# Altium project OLEDMiniFly.PrjPCB
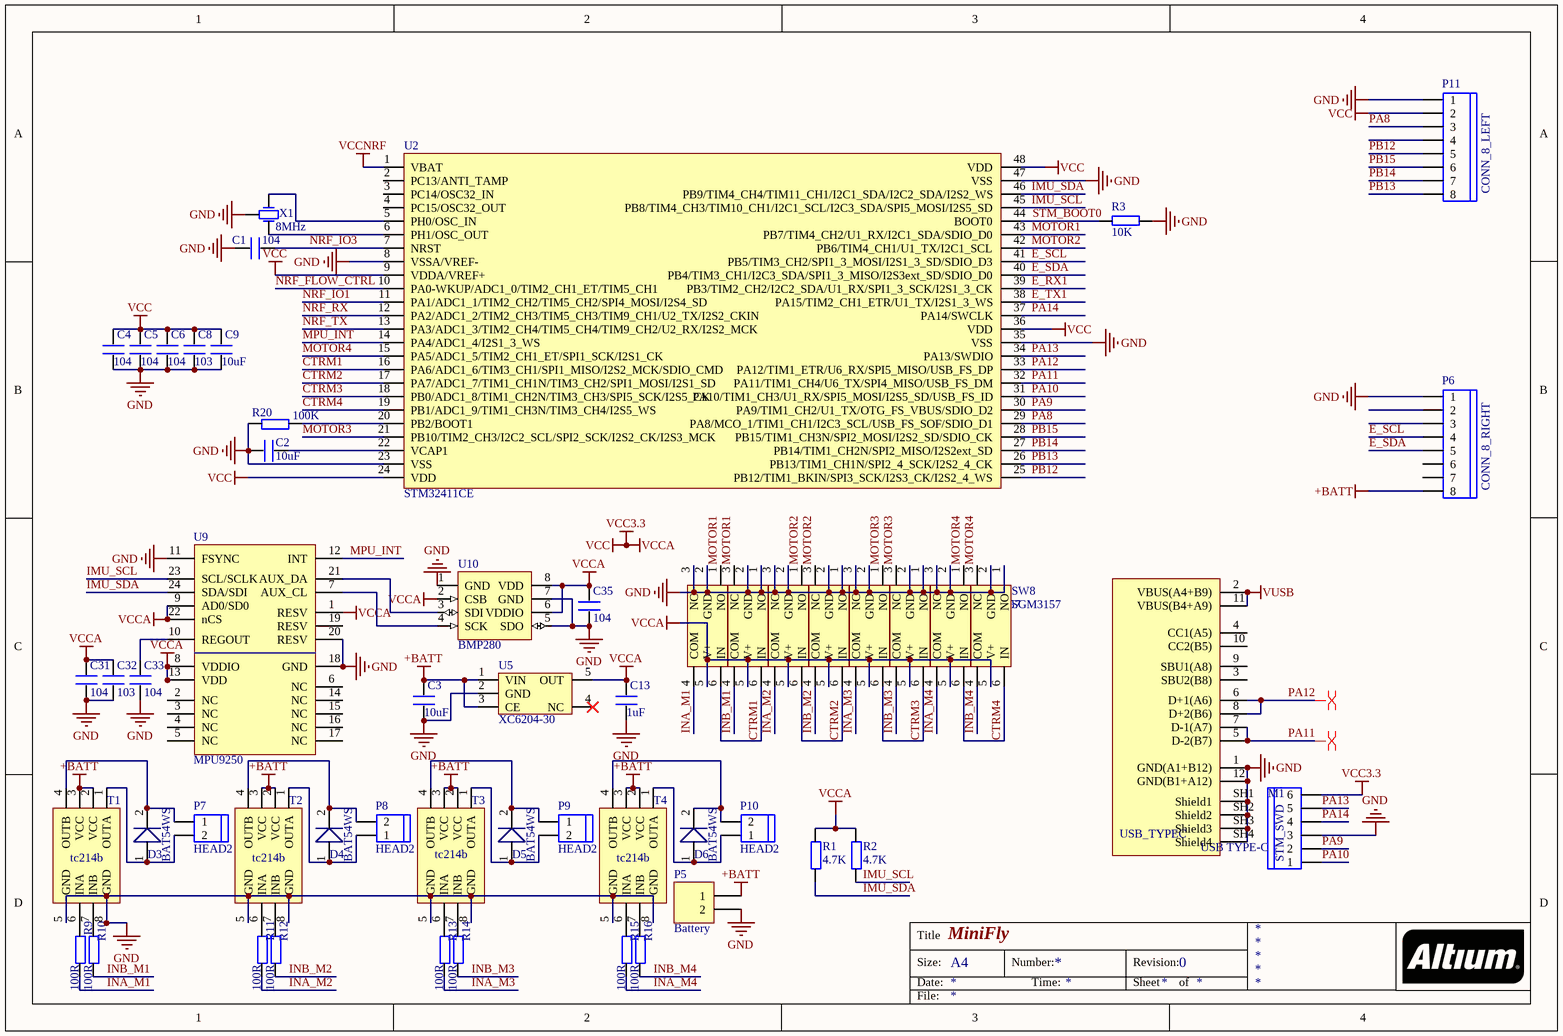
[diagram p0: OLEDMiniFlyMCU.SchDoc]
2 sheets, 83 parts. Net scope: global (net labels, ports and power ports of the same name join across sheets).
Board file: OLEDMiniFly.PcbDoc
Sheets:
  OLEDMiniFlyMCU.SchDoc
  OLEDMiniFlyNRF.SchDoc

## Sheet OLEDMiniFlyMCU.SchDoc: MiniFly
size A4; Author: liujun6037; Revision: 0; Version: V1.32; SheetSize: A4

### Parts
C1  104  [C 0603_L]
C2  10uF  [C 0603_L]
C3  10uF  [C 0603_L]
C4  104  [C 0603_L]
C5  104  [C 0603_L]
C6  104  [C 0603_L]
C8  103  [C 0603_L]
C9  10uF  [C 0603_L]
C13  1uF  [C 0603_L]
C31  104  [C 0603_L]
C32  103  [C 0603_L]
C33  104  [C 0603_L]
C35  104  [C 0603_L]
D3  BAT54WS  [SOD-323]
D4  BAT54WS  [SOD-323]
D5  BAT54WS  [SOD-323]
D6  BAT54WS  [SOD-323]
M1  STM_SWD  [SH1.0_6P]
P5  Battery  [HDR1X2]
P6  CONN_8_RIGHT  [HEADER8-2.0MM]
P7  HEAD2  [HEADER2-1.25MM]
P8  HEAD2  [HEADER2-1.25MM]
P9  HEAD2  [HEADER2-1.25MM]
P10  HEAD2  [HEADER2-1.25MM]
P11  CONN_8_LEFT  [HEADER8-2.0MM]
R1  4.7K  [R 0603_L]
R2  4.7K  [R 0603_L]
R3  10K  [R 0603_L]
R9  100R  [R 0603_L]
R10  100R  [R 0603_L]
R11  100R  [R 0603_L]
R12  100R  [R 0603_L]
R13  100R  [R 0603_L]
R14  100R  [R 0603_L]
R15  100R  [R 0603_L]
R16  100R  [R 0603_L]
R20  100K  [R 0603_L]
SW1  SGM3157  [SOT363-6L]
SW2  SGM3157  [SOT363-6L]
SW3  SGM3157  [SOT363-6L]
SW4  SGM3157  [SOT363-6L]
SW5  SGM3157  [SOT363-6L]
SW6  SGM3157  [SOT363-6L]
SW7  SGM3157  [SOT363-6L]
SW8  SGM3157  [SOT363-6L]
T1  tc214b  [SOP8_L]
T2  tc214b  [SOP8_L]
T3  tc214b  [SOP8_L]
T4  tc214b  [SOP8_L]
U2  STM32411CE  [UFQFPN48]
U5  XC6204-30  [SOT23-5L]
U9  MPU9250  [MPU9250]
U10  BMP280  [LGA-8]
USB_TYPEC  USB TypeC  [USB Type-C]  (value not drawn)
X1  8MHz  [XTAL-3215-3P]

### Nets
+BATT: C3.2 P5.1 P6.8 T1.2(VCC) T1.3(VCC) T2.2(VCC) T2.3(VCC) T3.2(VCC) T3.3(VCC) T4.2(VCC) T4.3(VCC) U5.1(VIN) U5.3(CE)
GND: C1.2 C2.1 C3.1 C4.1 C5.1 C6.1 C8.1 C9.1 C13.1 C31.1 C32.1 C33.1 C35.1 M1.3 P5.2 P6.1 P11.1 R3.1 R20.1 SW1.2(GND) SW1.3(NC) SW2.1(NO) SW2.2(GND) SW3.2(GND) SW3.3(NC) SW4.1(NO) SW4.2(GND) SW5.2(GND) SW5.3(NC) SW6.1(NO) SW6.2(GND) SW7.2(GND) SW7.3(NC) SW8.1(NO) SW8.2(GND) T1.5(GND) T1.8(GND) T2.5(GND) T2.8(GND) T3.5(GND) T3.8(GND) T4.5(GND) T4.8(GND) U2.8(VSSA/VREF-) U2.23(VSS) U2.35(VSS) U2.47(VSS) U5.2(GND) U9.11(FSYNC) U9.18(GND) U9.20(RESV) U10.1(GND) U10.5(SDO) U10.7(GND) USB_TYPEC.1(GND(A1+B12)) USB_TYPEC.12(GND(B1+A12)) USB_TYPEC.SH1(Shield1) USB_TYPEC.SH2(Shield2) USB_TYPEC.SH3(Shield3) USB_TYPEC.SH4(Shield4) X1.2(GND)
VCC: C4.2 C5.2 C6.2 C8.2 C9.2 C13.2 C31.2 C32.2 C35.2 M1.6 P11.2 R1.2 R2.2 SW1.5(V+) SW2.5(V+) SW3.5(V+) SW4.5(V+) SW5.5(V+) SW6.5(V+) SW7.5(V+) SW8.5(V+) U2.9(VDDA/VREF+) U2.24(VDD) U2.36(VDD) U2.48(VDD) U5.5(OUT) U9.1(RESV) U9.8(VDDIO) U9.9(AD0/SD0) U9.13(VDD) U9.22(nCS) U10.2(CSB) U10.6(VDDIO) U10.8(VDD)  [also labelled VCC3.3, VCCA]
VCCNRF: U2.1(VBAT)
VUSB: USB_TYPEC.2(VBUS(A4+B9)) USB_TYPEC.11(VBUS(B4+A9))
CTRM1: SW1.6(IN) SW2.6(IN) U2.16(PA6/ADC1_6/TIM3_CH1/SPI1_MISO/I2S2_MCK/SDIO_CMD)
CTRM2: SW3.6(IN) SW4.6(IN) U2.17(PA7/ADC1_7/TIM1_CH1N/TIM3_CH2/SPI1_MOSI/I2S1_SD)
CTRM3: SW5.6(IN) SW6.6(IN) U2.18(PB0/ADC1_8/TIM1_CH2N/TIM3_CH3/SPI5_SCK/I2S5_CK)
CTRM4: SW7.6(IN) SW8.6(IN) U2.19(PB1/ADC1_9/TIM1_CH3N/TIM3_CH4/I2S5_WS)
E_RX1: U2.39(PB3/TIM2_CH2/I2C2_SDA/U1_RX/SPI1_3_SCK/I2S1_3_CK)
E_SCL: P6.4 U2.41(PB5/TIM3_CH2/SPI1_3_MOSI/I2S1_3_SD/SDIO_D3)
E_SDA: P6.5 U2.40(PB4/TIM3_CH1/I2C3_SDA/SPI1_3_MISO/I2S3ext_SD/SDIO_D0)
E_TX1: U2.38(PA15/TIM2_CH1_ETR/U1_TX/I2S1_3_WS)
IMU_SCL: R2.1 U2.45(PB8/TIM4_CH3/TIM10_CH1/I2C1_SCL/I2C3_SDA/SPI5_MOSI/I2S5_SD) U9.23(SCL/SCLK)
IMU_SDA: R1.1 U2.46(PB9/TIM4_CH4/TIM11_CH1/I2C1_SDA/I2C2_SDA/I2S2_WS) U9.24(SDA/SDI)
INA_M1: R9.1 SW1.4(COM)
INA_M2: R11.1 SW3.4(COM)
INA_M3: R13.1 SW5.4(COM)
INA_M4: R15.1 SW7.4(COM)
INB_M1: R10.1 SW2.4(COM)
INB_M2: R12.1 SW4.4(COM)
INB_M3: R14.1 SW6.4(COM)
INB_M4: R16.1 SW8.4(COM)
MOTOR1: SW1.1(NO) SW2.3(NC) U2.43(PB7/TIM4_CH2/U1_RX/I2C1_SDA/SDIO_D0)
MOTOR2: SW3.1(NO) SW4.3(NC) U2.42(PB6/TIM4_CH1/U1_TX/I2C1_SCL)
MOTOR3: SW5.1(NO) SW6.3(NC) U2.21(PB10/TIM2_CH3/I2C2_SCL/SPI2_SCK/I2S2_CK/I2S3_MCK)
MOTOR4: SW7.1(NO) SW8.3(NC) U2.15(PA5/ADC1_5/TIM2_CH1_ET/SPI1_SCK/I2S1_CK)
MPU_INT: U2.14(PA4/ADC1_4/I2S1_3_WS) U9.12(INT)
NRF_FLOW_CTRL: U2.10(PA0-WKUP/ADC1_0/TIM2_CH1_ET/TIM5_CH1)
NRF_IO1: U2.11(PA1/ADC1_1/TIM2_CH2/TIM5_CH2/SPI4_MOSI/I2S4_SD)
NRF_IO3: C1.1 U2.7(NRST)
NRF_RX: U2.12(PA2/ADC1_2/TIM2_CH3/TIM5_CH3/TIM9_CH1/U2_TX/I2S2_CKIN)
NRF_TX: U2.13(PA3/ADC1_3/TIM2_CH4/TIM5_CH4/TIM9_CH2/U2_RX/I2S2_MCK)
PA8: P11.3 U2.29(PA8/MCO_1/TIM1_CH1/I2C3_SCL/USB_FS_SOF/SDIO_D1)
PA9: M1.2 U2.30(PA9/TIM1_CH2/U1_TX/OTG_FS_VBUS/SDIO_D2)
PA10: M1.1 U2.31(PA10/TIM1_CH3/U1_RX/SPI5_MOSI/I2S5_SD/USB_FS_ID)
PA11: U2.32(PA11/TIM1_CH4/U6_TX/SPI4_MISO/USB_FS_DM) USB_TYPEC.5(D-2(B7)) USB_TYPEC.7(D-1(A7))
PA12: U2.33(PA12/TIM1_ETR/U6_RX/SPI5_MISO/USB_FS_DP) USB_TYPEC.6(D+1(A6)) USB_TYPEC.8(D+2(B6))
PA13: M1.5 U2.34(PA13/SWDIO)
PA14: M1.4 U2.37(PA14/SWCLK)
PB12: P11.5 U2.25(PB12/TIM1_BKIN/SPI3_SCK/I2S3_CK/I2S2_4_WS)
PB13: P11.8 U2.26(PB13/TIM1_CH1N/SPI2_4_SCK/I2S2_4_CK)
PB14: P11.7 U2.27(PB14/TIM1_CH2N/SPI2_MISO/I2S2ext_SD)
PB15: P11.6 U2.28(PB15/TIM1_CH3N/SPI2_MOSI/I2S2_SD/SDIO_CK)
STM_BOOT0: R3.2 U2.44(BOOT0)
NetC2_2: C2.2 U2.22(VCAP1)
NetC33_2: C33.2 U9.10(REGOUT)
NetD3_1: D3.1 P7.2 T1.1(OUTA)
NetD3_2: D3.2 P7.1 T1.4(OUTB)
NetD4_1: D4.1 P8.1 T2.1(OUTA)
NetD4_2: D4.2 P8.2 T2.4(OUTB)
NetD5_1: D5.1 P9.2 T3.1(OUTA)
NetD5_2: D5.2 P9.1 T3.4(OUTB)
NetD6_1: D6.1 P10.1 T4.1(OUTA)
NetD6_2: D6.2 P10.2 T4.4(OUTB)
NetR9_2: R9.2 T1.6(INA)
NetR10_2: R10.2 T1.7(INB)
NetR11_2: R11.2 T2.6(INA)
NetR12_2: R12.2 T2.7(INB)
NetR13_2: R13.2 T3.6(INA)
NetR14_2: R14.2 T3.7(INB)
NetR15_2: R15.2 T4.6(INA)
NetR16_2: R16.2 T4.7(INB)
NetR20_2: R20.2 U2.20(PB2/BOOT1)
NetU2_5: U2.5(PH0/OSC_IN) X1.1(OSC1)
NetU2_6: U2.6(PH1/OSC_OUT) X1.3(OSC2)
NetU9_7: U9.7(AUX_CL) U10.4(SCK)
NetU9_21: U9.21(AUX_DA) U10.3(SDI)

Not connected (* = marked no-connect by the designer): P6 2 3 6 7; P11 4; U2 2(PC13/ANTI_TAMP) 3(PC14/OSC32_IN) 4(PC15/OSC32_OUT); U5 4(NC)*; U9 2(NC) 3(NC) 4(NC) 5(NC) 6(NC) 14(NC) 15(NC) 16(NC) 17(NC) 19(RESV); USB_TYPEC 3(SBU2(B8)) 4(CC1(A5)) 9(SBU1(A8)) 10(CC2(B5))

### Layout directives
differential pair: PA11, PA12

### Notes on the sheet
- Title
- Size:
- Date:
- A4
- Number:
- Time:
- Revision:
- Sheet
- of
- File:
- (in symbol USB Type-C) USB TYPE-C

### Library data of the parts
C1-C6 C8 C9 C13 C31-C33 C35 = C
D3-D6 = BAT54: 单肖特基二极管
M1 = HEAD6
P5 = Header 2: Header, 2-Pin; LatestRevisionDate: 17-Jul-2002; LatestRevisionNote: Re-released for DXP Platform.; Publisher: Altium Limited
P6 P11 = HEAD8
R1-R3 R9-R16 R20 = R
SW1-SW8 = SGM3157: 单路双掷模拟开关
T1-T4 = tc214b: 马达驱动芯片
U2 = STM32F411xC_xE: STM32411xC_xE
U5 = XC6204
U9 = MPU9250: 9轴陀螺仪
U10 = BMP280: 气压传感器
USB_TYPEC = USB Type-C: 12P TypeC 母座
X1 = XTAL-3215

## Sheet OLEDMiniFlyNRF.SchDoc: MiniFly
size A4; Author: liujun6037; Revision: 0; Version: V1.32; SheetSize: A4
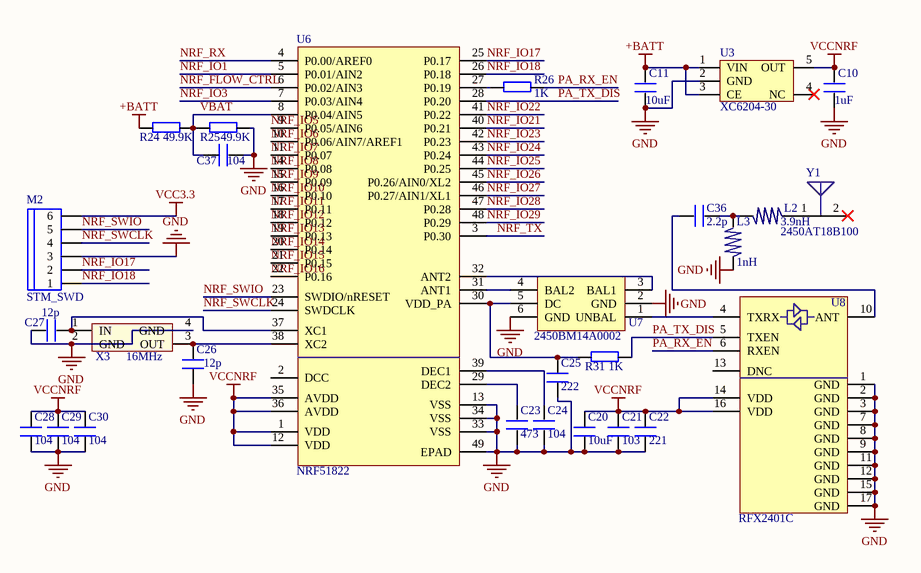
[diagram p1: OLEDMiniFlyNRF.SchDoc]

### Parts
C10  1uF  [C 0603_L]
C11  10uF  [C 0603_L]
C20  10uF  [C 0603_L]
C21  103  [C 0603_L]
C22  221  [C 0603_L]
C23  473  [C 0603_L]
C24  104  [C 0603_L]
C25  222  [C 0603_L]
C26  12p  [C 0603_L]
C27  12p  [C 0603_L]
C28  104  [C 0603_L]
C29  104  [C 0603_L]
C30  104  [C 0603_L]
C36  2.2p  [0402]
C37  104  [C 0603_L]
L2  3.9nH  [0402]
L3  1nH  [0402]
M2  STM_SWD  [SH1.0_6P]
R24  49.9K  [R 0603_L]
R25  49.9K  [R 0603_L]
R26  1K  [R 0603_L]
R31  1K  [R 0603_L]
U3  XC6204-30  [SOT23-5L]
U6  NRF51822  [QFN48M-04]
U7  2450BM14A0002  [0603-6]
U8  RFX2401C  [QFN16M]
X3  16MHz  [OSC32254Pmini]
Y1  2450AT18B100  [L 1206]

### Nets
+BATT: C11.2 R24.2 U3.1(VIN) U3.3(CE)
GND: C10.1 C11.1 C20.2 C21.2 C22.2 C23.2 C24.2 C25.2 C26.1 C27.2 C28.2 C29.2 C30.2 C37.1 L3.2 M2.3 R25.1 U3.2(GND) U6.13(VSS) U6.33(VSS) U6.34(VSS) U6.49(EPAD) U7.2(GND) U7.6(GND) U8.1(GND) U8.2(GND) U8.3(GND) U8.7(GND) U8.8(GND) U8.9(GND) U8.11(GND) U8.12(GND) U8.15(GND) U8.17(GND) X3.2(GND) X3.4(GND)
VCC3.3: M2.6  [project net VCC]
VCCNRF: C10.2 C20.1 C21.1 C22.1 C28.1 C29.1 C30.1 U3.5(OUT) U6.1(VDD) U6.12(VDD) U6.35(AVDD) U6.36(AVDD) U8.14(VDD) U8.16(VDD)
NRF_FLOW_CTRL: U6.6(P0.02/AIN3)
NRF_IO1: U6.5(P0.01/AIN2)
NRF_IO3: U6.7(P0.03/AIN4)
NRF_IO5: U6.9(P0.05/AIN6)
NRF_IO6: U6.10(P0.06/AIN7/AREF1)
NRF_IO7: U6.11(P0.07)
NRF_IO8: U6.14(P0.08)
NRF_IO9: U6.15(P0.09)
NRF_IO10: U6.16(P0.10)
NRF_IO11: U6.17(P0.11)
NRF_IO12: U6.18(P0.12)
NRF_IO13: U6.19(P0.13)
NRF_IO14: U6.20(P0.14)
NRF_IO15: U6.21(P0.15)
NRF_IO16: U6.22(P0.16)
NRF_IO17: M2.2 U6.25(P0.17)
NRF_IO18: M2.1 U6.26(P0.18)
NRF_IO21: U6.40(P0.21)
NRF_IO22: U6.41(P0.22)
NRF_IO23: U6.42(P0.23)
NRF_IO24: U6.43(P0.24)
NRF_IO25: U6.44(P0.25)
NRF_IO26: U6.45(P0.26/AIN0/XL2)
NRF_IO27: U6.46(P0.27/AIN1/XL1)
NRF_IO28: U6.47(P0.28)
NRF_IO29: U6.48(P0.29)
NRF_RX: U6.4(P0.00/AREF0)
NRF_SWCLK: M2.4 U6.24(SWDCLK)
NRF_SWIO: M2.5 U6.23(SWDIO/nRESET)
NRF_TX: U6.3(P0.30)
PA_RX_EN: R26.1 U8.6(RXEN)
PA_TX_DIS: R31.1 U6.28(P0.20) U8.5(TXEN)
VBAT: C37.2 R24.1 R25.2 U6.8(P0.04/AIN5)
NetC23_1: C23.1 U6.29(DEC2)
NetC24_1: C24.1 U6.39(DEC1)
NetC25_1: C25.1 R31.2 U6.30(VDD_PA) U7.5(DC)
NetC26_2: C26.2 U6.38(XC2) X3.3(OUT)
NetC27_1: C27.1 U6.37(XC1) X3.1(IN)
NetC36_1: C36.1 U8.10(ANT)
NetC36_2: C36.2 L2.2 L3.1
NetL2_1: L2.1 Y1.1(FP)
NetR26_2: R26.2 U6.27(P0.19)
NetU6_31: U6.31(ANT1) U7.4(BAL2)
NetU6_32: U6.32(ANT2) U7.3(BAL1)
NetU7_1: U7.1(UNBAL) U8.4(TXRX)

Not connected (* = marked no-connect by the designer): U3 4(NC)*; U6 2(DCC); U8 13(DNC); Y1 2(NC)*

### Notes on the sheet
- Title
- Size:
- Date:
- A4
- Number:
- Time:
- Revision:
- Sheet
- of
- File:

### Library data of the parts
C10 C11 C20-C30 C36 C37 = C
L2 L3 = L
M2 = HEAD6
R24-R26 R31 = R
U3 = XC6204
U7 = BALUN
X3 = XTAL-无源贴片: 无源贴片晶振
Y1 = CHIP_ANTENNA

## Nets that join several sheets
+BATT: OLEDMiniFlyMCU (13 pins), OLEDMiniFlyNRF (C11.2 R24.2 U3.1 U3.3)
GND: OLEDMiniFlyMCU (61 pins), OLEDMiniFlyNRF (36 pins)
VCC: OLEDMiniFlyMCU (34 pins), OLEDMiniFlyNRF (M2.6)
VCCNRF: OLEDMiniFlyMCU (U2.1), OLEDMiniFlyNRF (14 pins)
NRF_FLOW_CTRL: OLEDMiniFlyMCU (U2.10), OLEDMiniFlyNRF (U6.6)
NRF_IO1: OLEDMiniFlyMCU (U2.11), OLEDMiniFlyNRF (U6.5)
NRF_IO3: OLEDMiniFlyMCU (C1.1 U2.7), OLEDMiniFlyNRF (U6.7)
NRF_RX: OLEDMiniFlyMCU (U2.12), OLEDMiniFlyNRF (U6.4)
NRF_TX: OLEDMiniFlyMCU (U2.13), OLEDMiniFlyNRF (U6.3)